# EAGLE design untitled (EAGLE 9.6.2)
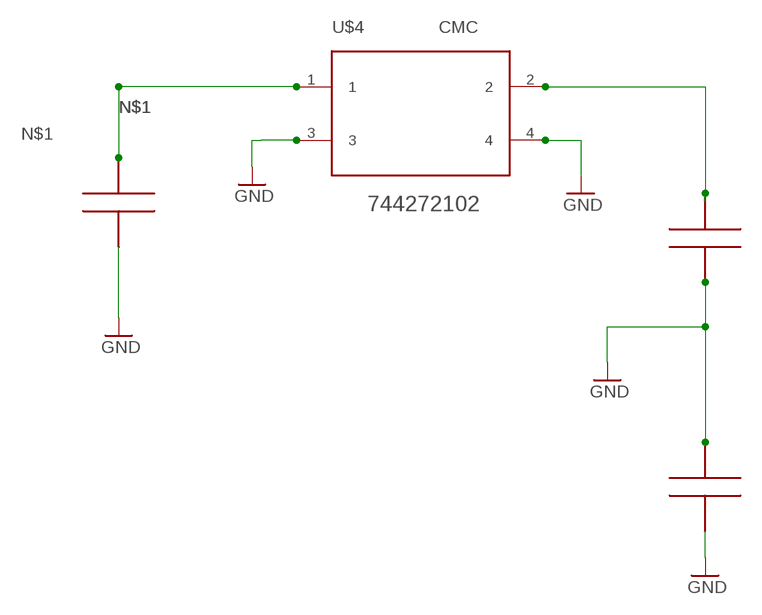
[diagram p0: schematic, sheet 1]

## Parts
C1  CAPA1210  [FGJGFN]
C2  CAPA1210  [FGJGFN]
U$3  CAPA1210  [FGJGFN]
U$4  CHOKE  [CHOKE]

## Nets
GND: C1.1 C2.1 U$3.1 U$3.2 U$4.3 U$4.4
N$1: C1.2 U$4.1
N$2: C2.2 U$4.2

## Library data of the parts
C1 C2 U$3 = capa:CAPA
U$4 = CHOKE:CHOKE

## Board
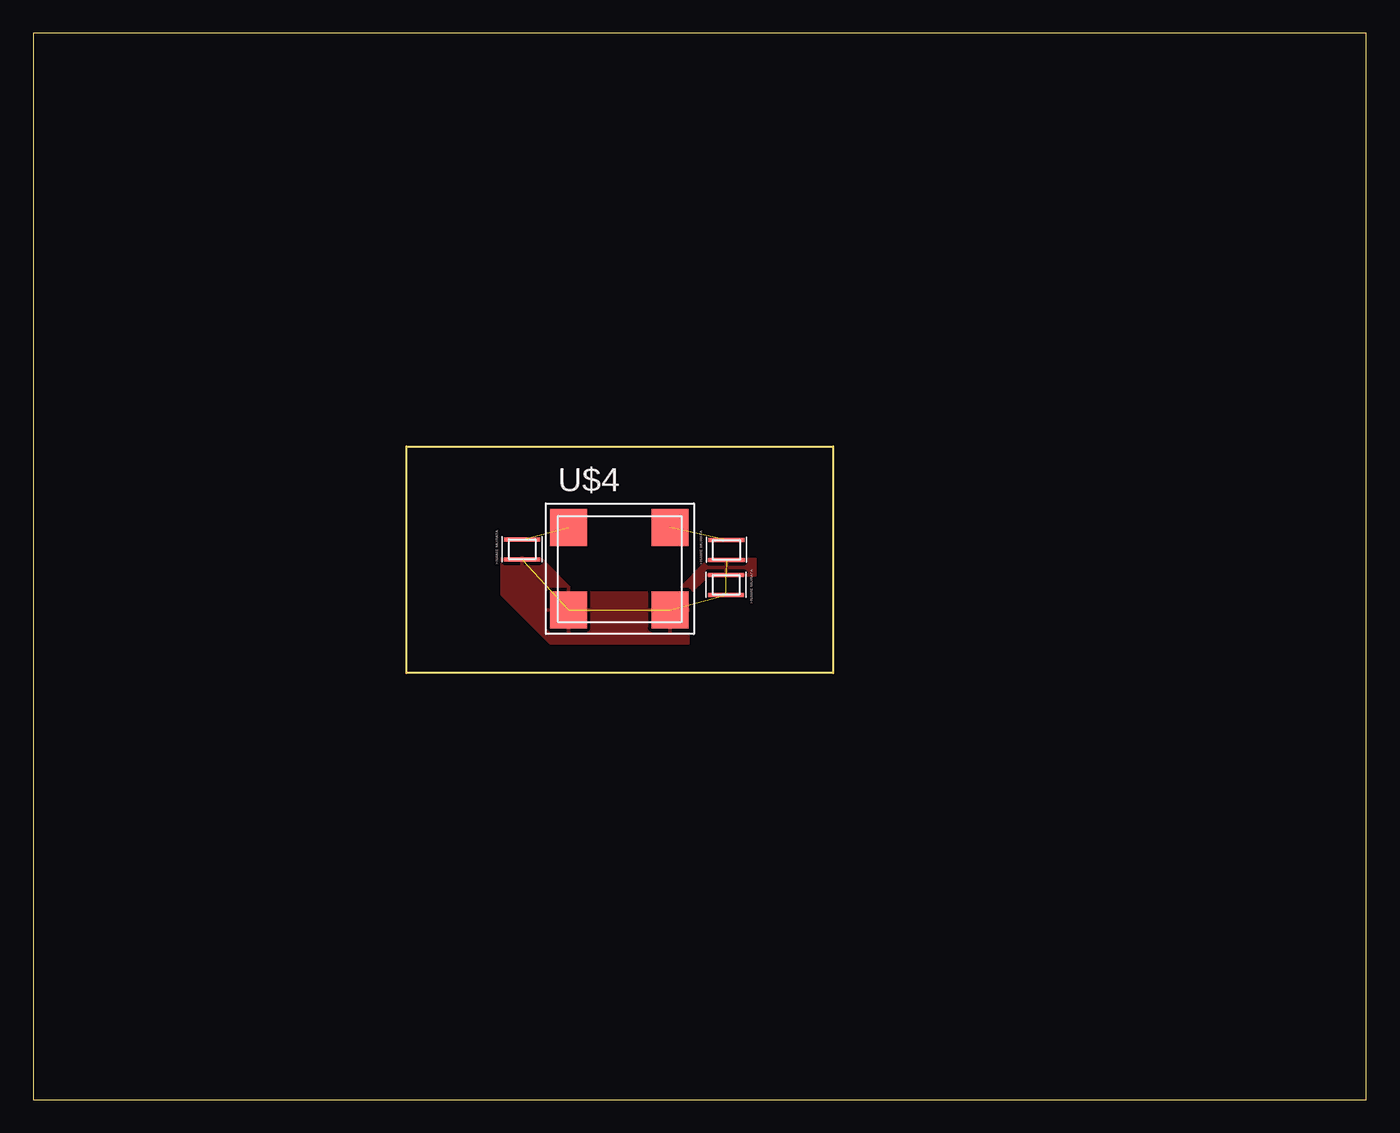
[diagram p1: board, top side]

Size 100 x 80 mm. Coordinates in mm from the lower left corner, seen from the top.
Outline: 0,0 100,0 100,80 0,80 0,0
Outline: 28,49 60,49 60,32 28,32 28,49
Copper layers (1*16): Top 0.035mm / dielectric 1.5mm / Bottom 0.035mm
Design rules "default": minimum track width 6mil, minimum drill 0.35mm, track to track 6mil, track to pad 6mil, pad to pad 6mil, via to via 6mil, smd to smd 6mil, copper to edge 40mil, drill to drill 6mil, minimum pad ring 10mil, minimum via ring 8mil, stop-mask expansion 4mil, vias tented up to drill 0mil, thermal gap 10mil

### Footprints (pad centres in the part's own frame; a part is rotated, then mirrored left to right if it is on the bottom)
FGJGFN = smd 0.3 x 2.7: 1 -13.5,0; 2 -12,0
CHOKE = smd 2.76 x 2.76: 1 -7.6,0; 2 0,0; 3 0,-6.2; 4 -7.6,-6.2

### Placement (x,y rotation side)
C1  36.68,54.03 90 top
C2  52,54 90 top
U$3  51.98,25.87 270 top
U$4  47.76,42.93 0 top

### Tracks (layer width: path | path; a pad name or v marks a point on that pad's centre or on a via)
GND  (5 unrouted)
  pour Top: 35.1,40.7 38,40.7 40.6,38.1 48.2,38.1 50.7,40.6 54.2,40.6 54.2,39.3 50.6,39.3 49.2,37.9 49.2,34.2 38.8,34.2 35.1,37.9
N$1  (1 unrouted)
N$2  (1 unrouted)